# Altium schematic sheet MainBoard.schdoc
size 309 x 223 mm; Symbol: Sheet-Symbol_A4; Device: Sheet-Symbol_A4; @Page Name: P1; @Create Date: 2023-08-17; @Page Count: 1; @Page No: 1; @Project Name: IntelliTar; @Schematic Name: Schematic2; @Update Date: 2023-08-20; Company: 嘉立创EDA; Page Size: A4; Version: V1.0
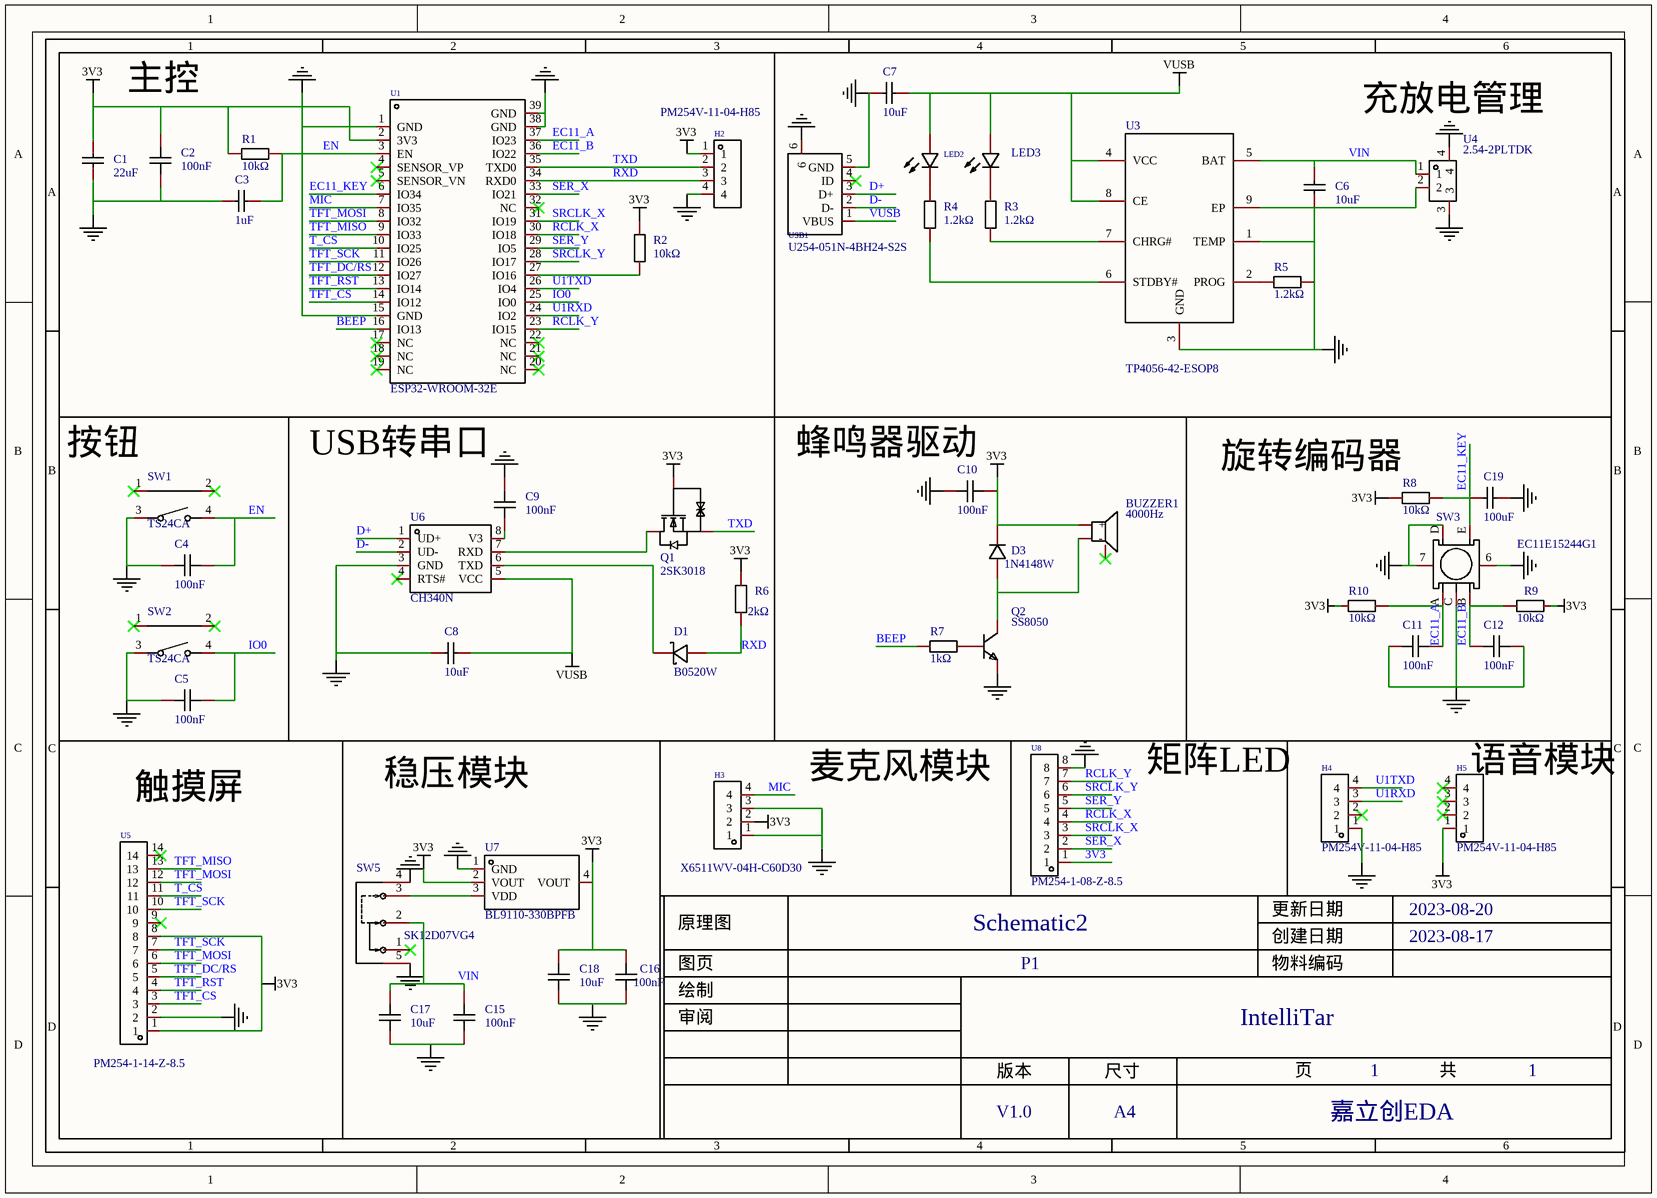
[diagram p0: MainBoard.schdoc]

## Parts
BUZZER1  4000Hz  [BUZ-SMD_L5.0-W5.5-P4.60]
C1  22uF  [C1206]
C2  100nF  [C0603]
C3  1uF  [C0603]
C4  100nF  [C0603]
C5  100nF  [C0603]
C6  10uF  [C0805]
C7  10uF  [C0805]
C8  10uF  [C0805]
C9  100nF  [C0603]
C10  100nF  [C0603]
C11  100nF  [C0603]
C12  100nF  [C0603]
C15  100nF  [C0603]
C16  100nF  [C0603]
C17  10uF  [C0603]
C18  10uF  [C0603]
C19  100uF  [C1206]
D1  B0520W  [SOD-123_L2.7-W1.6-LS3.7-RD]
D3  1N4148W  [SOD-123F_L2.7-W1.6-LS3.8-RD]
H2  PM254V-11-04-H85  [HDR-TH_4P-P2.54-V-F]
H3  X6511WV-04H-C60D30  [HDR-TH_4P-P2.54-V-M]
H4  PM254V-11-04-H85  [HDR-TH_4P-P2.54-V-F]
H5  PM254V-11-04-H85  [HDR-TH_4P-P2.54-V-F]
LED2  19-217/GHC-YR1S2/3T  [LED0603-RD]  (value not drawn)
LED3  NCD0603R1  [LED0603-RD_RED]  (value not drawn)
Q1  2SK3018  [SOT-23-3_L2.9-W1.4-P1.90-LS2.6-BR]
Q2  SS8050  [SOT-23-3_L2.9-W1.3-P1.90-LS2.4-BR]
R1  10kΩ  [R0603]
R2  10kΩ  [R0603]
R3  1.2kΩ  [R0603]
R4  1.2kΩ  [R0603]
R5  1.2kΩ  [R0603]
R6  2kΩ  [R0603]
R7  1kΩ  [R0603]
R8  10kΩ  [R0603]
R9  10kΩ  [R0603]
R10  10kΩ  [R0603]
SW1  TS24CA  [SW-SMD_TS24CA]
SW2  TS24CA  [SW-SMD_TS24CA]
SW3  EC11E15244G1  [SW-TH_EC11E15244G1]
SW5  SK12D07VG4  [SW-TH_SK12D07VG4]
U1  ESP32-WROOM-32E  [WIFI-SMD_ESP32-WROOM-32E-A]
U3  TP4056-42-ESOP8  [ESOP-8_L4.9-W3.9-P1.27-LS6.0-BL-EP]
U4  2.54-2PLTDK  [COMM-SMD_2P-P2.50_SHOUHAN_2.54-2PLTDK]
U5  PM254-1-14-Z-8.5  [HDR-TH_14P-P2.54-V-F-1]
U6  CH340N  [SOP-8_L5.0-W4.0-P1.27-LS6.0-BL]
U7  BL9110-330BPFB  [SOT-223_L6.5-W3.5-P2.30-LS7.0-BR]
U8  PM254-1-08-Z-8.5  [HDR-TH_8P-P2.54-V-F]
USB1  U254-051N-4BH24-S2S  [MICRO-USB-SMD_U254-051N-4BH24-S2]

## Blocks framed on the sheet
主控: C1-C3 H2 R1 R2 U1
充放电管理: C6 C7 LED2 LED3 R3-R5 U3 U4 USB1
按钮: C4 C5 SW1 SW2
USB转串口: C8 C9 D1 Q1 R6 U6
蜂鸣器驱动: BUZZER1 C10 D3 Q2 R7
旋转编码器: C11 C12 C19 R8-R10 SW3
触摸屏: U5
稳压模块: C15-C18 SW5 U7
麦克风模块: H3
矩阵LED: U8

## Nets
3V3: BUZZER1.1(+) C1.2 C2.2 C10.2 C16.2 C18.2 D3.1(K) H2.1 H3.2 H5.1 Q1.1(G) R1.1 R2.2 R6.2 R8.2 R9.2 R10.2 U1.2(3V3) U5.1 U5.8 U7.2(VOUT) U7.4(VOUT) U8.1
NetC1_1: C1.1 C2.1 C3.1 C4.1 C5.1 C6.2 C7.1 C8.1 C9.2 C10.1 C11.2 C12.2 C15.1 C16.1 C17.1 C18.1 C19.2 H2.4 H3.1 H3.3 H4.1 Q2.2(E) R5.2 SW1.3 SW2.3 SW3.6 SW3.7 SW3.C SW3.D SW5.4 SW5.5 U1.1(GND) U1.15(GND) U1.38(GND) U1.39(GND) U3.1(TEMP) U3.3(GND) U3.9(EP) U4.2 U4.3 U4.4 U5.2 U6.3(GND) U7.1(GND) U8.8 USB1.5(GND) USB1.6
VUSB: C7.2 C8.2 LED2.2(A) LED3.2(A) U3.4(VCC) U3.8(CE) U6.5(VCC) USB1.1(VBUS)
BEEP: R7.1 U1.16(IO13)
D+: U6.1(UD+) USB1.3(D+)
D-: U6.2(UD-) USB1.2(D-)
EC11_A: C11.1 R10.1 SW3.A U1.37(IO23)
EC11_B: C12.1 R9.1 SW3.B U1.36(IO22)
EC11_KEY: C19.1 R8.1 SW3.E U1.6(IO34)
EN: C3.2 C4.2 R1.2 SW1.4 U1.3(EN)
IO0: C5.2 SW2.4 U1.25(IO0)
MIC: H3.4 U1.7(IO35)
RCLK_X: U1.30(IO18) U8.4
RCLK_Y: U1.23(IO15) U8.7
RXD: D1.2(A) H2.3 R6.1 U1.34(RXD0)
SER_X: U1.33(IO21) U8.2
SER_Y: U1.29(IO5) U8.5
SRCLK_X: U1.31(IO19) U8.3
SRCLK_Y: U1.28(IO17) U8.6
T_CS: U1.10(IO25) U5.11
TFT_CS: U1.14(IO12) U5.3
TFT_DC/RS: U1.12(IO27) U5.5
TFT_MISO: U1.9(IO33) U5.13
TFT_MOSI: U1.8(IO32) U5.6 U5.12
TFT_RST: U1.13(IO14) U5.4
TFT_SCK: U1.11(IO26) U5.7 U5.10
TXD: H2.2 Q1.2(S) U1.35(TXD0)
U1RXD: H4.3 U1.24(IO2)
U1TXD: H4.4 U1.26(IO4)
VIN: C6.1 C15.2 C17.2 SW5.2 U3.5(BAT) U4.1
NetBUZZER1_2: BUZZER1.2(-) D3.2(A) Q2.3(C)
NetC9_1: C9.1 U6.8(V3)
NetD1_1: D1.1(C) U6.6(TXD)
NetLED2_1: LED2.1(C) R4.2
NetLED3_1: LED3.1(K) R3.2
NetQ1_3: Q1.3(D) U6.7(RXD)
NetQ2_1: Q2.1(B) R7.2
NetR2_1: R2.1 U1.27(IO16)
NetR3_1: R3.1 U3.7(CHRG#)
NetR4_1: R4.1 U3.6(STDBY#)
NetR5_1: R5.1 U3.2(PROG)
NetSW5_3: SW5.3 U7.3(VDD)

Not connected (* = marked no-connect by the designer): BUZZER1 3(NC)*; H4 2*; H5 2* 3* 4*; SW1 1* 2*; SW2 1* 2*; SW5 1*; U1 4(SENSOR_VP)* 5(SENSOR_VN)* 17(NC)* 18(NC)* 19(NC)* 20(NC)* 21(NC)* 22(NC)* 32(NC)*; U5 9* 14*; U6 4(RTS#)*; USB1 4(ID)*

## Notes on the sheet
- (near H5) 语音模块
- 1
- 2
- 3
- 4
- 5
- 6
- A
- B
- C
- 原理图
- Schematic2
- 创建日期
- 更新日期
- 2023-08-17
- 2023-08-20
- 审阅
- 绘制
- 图页
- P1
- 物料编码
- IntelliTar
- D
- 版本
- 尺寸
- 页
- 共
- V1.0
- A4
- 嘉立创EDA

## Library data of the parts
BUZZER1 = MLT-5020: 驱动方式:无源(外部驱动);构造类型:电磁式;频率:4000Hz;长度:5.2mm;宽度:5.2mm;高度:2.5mm;; Manufacturer: 华能; Add into BOM: yes; Technology Type: 电磁式; Name: 4000Hz; Symbol: MLT-5020; Device: MLT-5020; LCSC Part Name: MLT-5020; Supplier Part: C94598; Manufacturer Part: MLT-5020; Supplier Footprint: SMD,5x5mm; JLCPCB Part Class: 扩展库; Datasheet: https://atta.szlcsc.com/upload/public/pdf/source/20210811/111454390007D221D7259018FB170E62.pdf; Supplier: LCSC; Convert to PCB: yes; Oscillator Circuit: 无源(外部驱动); Value: 4000Hz; Length: 5.2mm; Width: 5.2mm; Height: 2.5mm
C1 = CL31A226KAHNNNE: 容值:22uF;精度:±10%;额定电压:25V;材质(温度系数):X5R;; Manufacturer: SAMSUNG(三星); Add into BOM: yes; Tolerance: ±10%; Voltage Rated: 25V; Temperature Coefficient: X5R; Name: 22uF; Symbol: CL31A226KAHNNNE; Device: CL31A226KAHNNNE; LCSC Part Name: 22uF ±10% 25V; Supplier Part: C12891; Manufacturer Part: CL31A226KAHNNNE; Supplier Footprint: 1206; JLCPCB Part Class: 基础库; Datasheet: https://atta.szlcsc.com/upload/public/pdf/source/20160103/1457707667836.pdf; Supplier: LCSC; Convert to PCB: yes; Value: 22uF
C2 C4 C5 C9-C12 C15 C16 = CC0603KRX7R9BB104: 容值:100nF;精度:±10%;额定电压:50V;材质(温度系数):X7R;; Manufacturer: YAGEO(国巨); Add into BOM: yes; Tolerance: ±10%; Voltage Rated: 50V; Temperature Coefficient: X7R; Name: 100nF; Symbol: CC0603KRX7R9BB104; Device: CC0603KRX7R9BB104; LCSC Part Name: 100nF ±10% 50V; Supplier Part: C14663; Manufacturer Part: CC0603KRX7R9BB104; Supplier Footprint: 0603; JLCPCB Part Class: 基础库; Datasheet: https://atta.szlcsc.com/upload/public/pdf/source/20180910/C282072_33301C7F631E79921B82A8DAC6BCC5B3.pdf; Supplier: LCSC; Convert to PCB: yes; Value: 100nF
C3 = CL10A105KB8NNNC: 容值:1uF;精度:±10%;额定电压:50V;材质(温度系数):X5R;; Manufacturer: SAMSUNG(三星); Add into BOM: yes; Tolerance: ±10%; Voltage Rated: 50V; Temperature Coefficient: X5R; Name: 1uF; Symbol: CL10A105KB8NNNC; Device: CL10A105KB8NNNC; LCSC Part Name: 1uF ±10% 50V; Supplier Part: C15849; Manufacturer Part: CL10A105KB8NNNC; Supplier Footprint: 0603; JLCPCB Part Class: 基础库; Datasheet: https://atta.szlcsc.com/upload/public/pdf/source/20160103/1457707679084.pdf; Supplier: LCSC; Convert to PCB: yes; Value: 1uF
C6-C8 = CL21A106KAYNNNE_C15850: 容值:10uF;精度:±10%;额定电压:25V;材质(温度系数):X5R;; Manufacturer: SAMSUNG(三星); Add into BOM: yes; Tolerance: ±10%; Voltage Rated: 25V; Temperature Coefficient: X5R; Name: 10uF; Symbol: CL21A106KAYNNNE; Device: CL21A106KAYNNNE_C15850; LCSC Part Name: 10uF ±10% 25V; Supplier Part: C15850; Manufacturer Part: CL21A106KAYNNNE; Supplier Footprint: 0805; JLCPCB Part Class: Basic Part; Datasheet: https://atta.szlcsc.com/upload/public/pdf/source/20160103/1457707679302.pdf; Supplier: LCSC; Convert to PCB: yes; Value: 10uF
C17 C18 = CL10A106MA8NRNC: 容值:10uF;精度:±20%;额定电压:25V;材质(温度系数):X5R;; Manufacturer: SAMSUNG(三星); Add into BOM: yes; Tolerance: ±20%; Voltage Rated: 25V; Temperature Coefficient: X5R; Name: 10uF; Symbol: CL10A106MA8NRNC; Device: CL10A106MA8NRNC; LCSC Part Name: 10uF ±20% 25V; Supplier Part: C96446; Manufacturer Part: CL10A106MA8NRNC; Supplier Footprint: 0603; JLCPCB Part Class: 基础库; Datasheet: https://atta.szlcsc.com/upload/public/pdf/source/20170325/1490427913016.pdf; Supplier: LCSC; Convert to PCB: yes; Value: 10uF
C19 = CL31A107MQHNNNE: 容值:100uF;精度:±20%;额定电压:6.3V;材质(温度系数):X5R;; Manufacturer: SAMSUNG(三星); Add into BOM: yes; Tolerance: ±20%; Voltage Rated: 6.3V; Temperature Coefficient: X5R; Name: 100uF; Symbol: CL31A107MQHNNNE; Device: CL31A107MQHNNNE; LCSC Part Name: 100uF ±20% 6.3V; Supplier Part: C15008; Manufacturer Part: CL31A107MQHNNNE; Supplier Footprint: 1206; JLCPCB Part Class: 基础库; Datasheet: https://atta.szlcsc.com/upload/public/pdf/source/20160103/1457707673200.pdf; Supplier: LCSC; Convert to PCB: yes; Value: 100uF
D1 = B0520W_C475609: Manufacturer: SHIKUES(时科); Add into BOM: yes; Name: B0520W; Symbol: B0520W; Device: B0520W_C475609; LCSC Part Name: B0520W; Supplier Part: C475609; Manufacturer Part: B0520W; Supplier Footprint: SHIKUES(时科); JLCPCB Part Class: 扩展库; Datasheet: https://atta.szlcsc.com/upload/public/pdf/source/20200102/C475609_13CB8AED5CC45AEB99C797609B0FD70E.pdf; Supplier: LCSC; Convert to PCB: yes
D3 = 1N4148W_C81598: 二极管配置:独立式;功率:400mW;直流反向耐压(Vr):75V;平均整流电流(Io):150mA;正向压降(Vf):1V@50mA;反向恢复时间(trr):4ns;; Manufacturer: ST(先科); Add into BOM: yes; Diode Configuration: 独立式; Power Dissipation: 400mW; Reverse Voltage (Vr): 75V; Average Rectified Current (Io): 150mA; Reverse Leakage Current: 1uA@75V; Reverse Recovery Time (trr): 4ns; Name: 1N4148W; Symbol: 1N4148W_C81598; Device: 1N4148W_C81598; LCSC Part Name: 75V 150mA 4ns; Supplier Part: C81598; Manufacturer Part: 1N4148W; Supplier Footprint: SOD-123; JLCPCB Part Class: 基础库; Datasheet: https://atta.szlcsc.com/upload/public/pdf/source/20161024/1477288446905.pdf; Supplier: LCSC; Convert to PCB: yes; Forward Voltage (Vf@If): 1V@50mA; Operating Temperature: +150℃@(Tj)
H2 H4 H5 = PM254V-11-04-H85: 排数:单排;总孔位数:4;间距:2.54mm;插孔结构:1x4P;行距:-;安装类型:直插;塑高:-;触头材质:黄铜;触头镀层:-;; Manufacturer: XFCN(兴飞); Add into BOM: yes; Number of Holes: 4; Pitch: 2.54mm; Holes Structure: 1x4P; Name: PM254V-11-04-H85; Symbol: PM254V-11-04-H85; Device: PM254V-11-04-H85; LCSC Part Name: 2.54mm 1x4P; Supplier Part: C541851; Manufacturer Part: PM254V-11-04-H85; Supplier Footprint: 直插,P=2.54mm; JLCPCB Part Class: 扩展库; Supplier: LCSC; Convert to PCB: yes; Number of Rows: 单排; Row Spacing: -; Mounting Type: 直插; Insulation Height: -; Contact Material: 黄铜; Contact Plating: -
H3 = X6511WV-04H-C60D30: 排数:单排;总PIN位数:4P;间距:2.54mm;插针结构:1x4P;行距:-;安装类型:直插;圆针/方针:方针;额定电流:3A;额定电压:250V;配合针长度:6mm;塑高:2.5mm;端接针长度:3mm;触头材质:黄铜;触头镀层:金;工作温度范围:-40℃~+105℃;焊接温度(最大值):260℃;颜色:黑色;; Manufacturer: XKB Connectivity(中国星坤); Symbol: X6511WV-04H-C30D60; Add into BOM: yes; Pitch: 2.54mm; Pin Structure: 1x4P; Circluar Pins/Square Pins: 方针; Current Rating (Max): 3A; Voltage Rating (Max): 250V; Welding Temperature (Max): 260℃; Name: X6511WV-04H-C60D30; Device: X6511WV-04H-C60D30; LCSC Part Name: 2.54mm 1x4P 直插 方针 镀金足1U; Supplier Part: C706876; Manufacturer Part: X6511WV-04H-C60D30; Supplier Footprint: 插件,P=2.54mm; JLCPCB Part Class: 扩展库; Datasheet: https://atta.szlcsc.com/upload/public/pdf/source/20211009/D19569EFFEB9776B42364DF7D41FD96A.pdf; Supplier: LCSC; Convert to PCB: yes; Number of Rows: 单排; Number of Pins: 4P; Row Spacing: -; Mounting Type: 直插; Length of Mating Pin: 6mm; Insulation Height: 2.5mm; Length of End Connection Pin: 3mm; Contact Material: 黄铜; Contact Plating: 金; Operating Temperature Range: -40℃~+105℃; Color: 黑色
LED2 = 19-217/GHC-YR1S2/3T: 发光颜色:翠绿;二极管配置:-;主波长:520nm~535nm;色温:-;功率:110mW;安装方式:-;; Manufacturer: EVERLIGHT(亿光); Add into BOM: yes; Emitted Color: 翠绿; Lens Color: 无色透明; Peak Wavelength: 518nm; Forward Current: 20mA; Power Dissipation: 110mW; Viewing Angle: 120°; Name: 19-217/GHC-YR1S2/3T; Symbol: 19-217/GHC-YR1S2/3T; Device: 19-217/GHC-YR1S2/3T; LCSC Part Name: 翠绿; Supplier Part: C72043; Manufacturer Part: 19-217/GHC-YR1S2/3T; Supplier Footprint: 0603; JLCPCB Part Class: 基础库; Datasheet: https://atta.szlcsc.com/upload/public/pdf/source/20160507/1462613613780.pdf; Supplier: LCSC; Convert to PCB: yes; Diode Configuration: -; Dominant Wavelength: 520nm~535nm; Color Temperature: -; Mounting Sytle: -; Operating Temperature: -40℃~+85℃
LED3 = NCD0603R1_C84263: 发光颜色:红灯;; Manufacturer: 国星光电; Symbol: FC-DA1608HRK-620D; Add into BOM: yes; Emitted Color: 红灯; Name: NCD0603R1; Device: NCD0603R1_C84263; LCSC Part Name: 红灯; Supplier Part: C84263; Manufacturer Part: NCD0603R1; Supplier Footprint: 0603; JLCPCB Part Class: 扩展库; Datasheet: https://atta.szlcsc.com/upload/public/pdf/source/20200820/C84263_DABC6A75E58F576973B407FDBA283D60.pdf; Supplier: LCSC; Convert to PCB: yes
Q1 = 2SK3018: 类型:-;漏源电压(Vdss):-;连续漏极电流(Id):-;功率(Pd):-;导通电阻(RDS(on)@Vgs,Id):-;阈值电压(Vgs(th)@Id):-;栅极电荷(Qg@Vgs):-;输入电容(Ciss@Vds):-;反向传输电容(Crss@Vds):-;; Manufacturer: TWGMC(台湾迪嘉); Symbol: 2SK3018_C727148; Add into BOM: yes; Name: 2SK3018; Device: 2SK3018; LCSC Part Name: 2SK3018; Supplier Part: C727148; Manufacturer Part: 2SK3018; Supplier Footprint: SOT-23; JLCPCB Part Class: 扩展库; Datasheet: https://atta.szlcsc.com/upload/public/pdf/source/20200827/C727148_2301BBDB89FCE642A4A39ABEF7075607.pdf; Supplier: LCSC; Convert to PCB: yes; Type: -; Drain Source Voltage (Vdss): -; Continuous Drain Current (Id): -; Power Dissipation (Pd): -; Drain Source On Resistance (RDS(on)@Vgs,Id): -; Gate Threshold Voltage (Vgs(th)@Id): -; Total Gate Charge (Qg@Vgs): -; Input Capacitance (Ciss@Vds): -; Reverse Transfer Capacitance (Crss@Vds): -
Q2 = SS8050_C2150: 晶体管类型:NPN;集射极击穿电压(Vceo):25V;集电极电流(Ic):1.5A;功率(Pd):300mW;直流电流增益(hFE@Ic,Vce):200@100mA,1V;; Manufacturer: CJ(江苏长电/长晶); Add into BOM: yes; Transistor Type: NPN; Collector-Emitter Breakdown Voltage (Vceo): 25V; Collector Current (Ic): 1.5A; Power Dissipation (Pd): 300mW; Collector Cut-Off Current (Icbo): 100nA; Collector-Emitter Saturation Voltage (VCE(sat)@Ic,Ib): 500mV@800mA,80mA; Transition Frequency (fT): 100MHz; Name: SS8050; Symbol: SS8050_C2150; Device: SS8050_C2150; LCSC Part Name: NPN 25V 1.5A Y1 200-350; Supplier Part: C2150; Manufacturer Part: SS8050; Supplier Footprint: SOT-23; JLCPCB Part Class: 基础库; Datasheet: https://atta.szlcsc.com/upload/public/pdf/source/20230322/AEE86F4B043774EFF80CAEA14A37D9E9.pdf; Supplier: LCSC; Convert to PCB: yes; DC Current Gain (hFE@Ic,Vce): 200@100mA,1V; Operating Temperature: +150℃@(Tj)
R1 R2 R8-R10 = 0603WAF1002T5E: 电阻类型:厚膜电阻;阻值:10kΩ;精度:±1%;功率:100mW;; Manufacturer: UNI-ROYAL(厚声); Add into BOM: yes; Tolerance: ±1%; Power(Watts): 100mW; Temperature Coefficient: ±100ppm/℃; Overload Voltage (Max): 75V; Name: 10kΩ; Symbol: 0603WAF1002T5E; Device: 0603WAF1002T5E; LCSC Part Name: 厚膜电阻 10kΩ ±1% 100mW; Supplier Part: C25804; Manufacturer Part: 0603WAF1002T5E; Supplier Footprint: 0603; JLCPCB Part Class: 基础库; Datasheet: https://atta.szlcsc.com/upload/public/pdf/source/20200306/C422600_1E6D84923E4A46A82E41ADD87F860B5C.pdf; Supplier: LCSC; Convert to PCB: yes; Type: 厚膜电阻; Value: 10kΩ; Operating Temperature Range: -55℃~+155℃
R3-R5 = 0603WAF1201T5E: 电阻类型:厚膜电阻;阻值:1.2kΩ;精度:±1%;功率:100mW;; Manufacturer: UNI-ROYAL(厚声); Add into BOM: yes; Tolerance: ±1%; Power(Watts): 100mW; Temperature Coefficient: ±100ppm/℃; Overload Voltage (Max): 75V; Name: 1.2kΩ; Symbol: 0603WAF1201T5E; Device: 0603WAF1201T5E; LCSC Part Name: 1.2kΩ ±1% 100mW; Supplier Part: C22765; Manufacturer Part: 0603WAF1201T5E; Supplier Footprint: 0603; JLCPCB Part Class: 基础库; Datasheet: https://atta.szlcsc.com/upload/public/pdf/source/20200306/C422600_1E6D84923E4A46A82E41ADD87F860B5C.pdf; Supplier: LCSC; Convert to PCB: yes; Type: 厚膜电阻; Value: 1.2kΩ; Operating Temperature Range: -55℃~+155℃
R6 = 0603WAF2001T5E: 电阻类型:厚膜电阻;阻值:2kΩ;精度:±1%;功率:100mW;; Manufacturer: UNI-ROYAL(厚声); Add into BOM: yes; Tolerance: ±1%; Power(Watts): 100mW; Temperature Coefficient: ±100ppm/℃; Overload Voltage (Max): 75V; Name: 2kΩ; Symbol: 0603WAF2001T5E; Device: 0603WAF2001T5E; LCSC Part Name: 2kΩ ±1% 100mW; Supplier Part: C22975; Manufacturer Part: 0603WAF2001T5E; Supplier Footprint: 0603; JLCPCB Part Class: 基础库; Datasheet: https://atta.szlcsc.com/upload/public/pdf/source/20200306/C422600_1E6D84923E4A46A82E41ADD87F860B5C.pdf; Supplier: LCSC; Convert to PCB: yes; Type: 厚膜电阻; Value: 2kΩ; Operating Temperature Range: -55℃~+155℃
R7 = 0603WAF1001T5E: 电阻类型:厚膜电阻;阻值:1kΩ;精度:±1%;功率:100mW;; Manufacturer: UNI-ROYAL(厚声); Add into BOM: yes; Tolerance: ±1%; Power(Watts): 100mW; Temperature Coefficient: ±100ppm/℃; Overload Voltage (Max): 75V; Name: 1kΩ; Symbol: 0603WAF1001T5E; Device: 0603WAF1001T5E; LCSC Part Name: 1kΩ ±1% 100mW; Supplier Part: C21190; Manufacturer Part: 0603WAF1001T5E; Supplier Footprint: 0603; JLCPCB Part Class: 基础库; Datasheet: https://atta.szlcsc.com/upload/public/pdf/source/20200306/C422600_1E6D84923E4A46A82E41ADD87F860B5C.pdf; Supplier: LCSC; Convert to PCB: yes; Type: 厚膜电阻; Value: 1kΩ; Operating Temperature Range: -55℃~+155℃
SW1 SW2 = TS24CA: 触点电流:50mA;额定电压(DC):12V;电路结构:单刀单掷;安装方式:卧贴;带灯:-;机械寿命:-;; Manufacturer: SHOU HAN(首韩); Add into BOM: yes; Contact Current: 50mA; Voltage Rating (DC): 12V; Circuit: 单刀单掷; Actuator Style: 矩形按钮; Switch Length: 4.55mm; Switch Width: 1.8mm; Switch Height: 3.5mm; Name: TS24CA; Symbol: TS24CA; Device: TS24CA; LCSC Part Name: 4.55*1.8*3.5mm 卧贴 轻触开关; Supplier Part: C393942; Manufacturer Part: TS24CA; Supplier Footprint: SMD; JLCPCB Part Class: 扩展库; Datasheet: https://atta.szlcsc.com/upload/public/pdf/source/20190521/C393942_591A9E318887EFA4274D34029981AD99.pdf; Supplier: LCSC; Convert to PCB: yes; Mounting Style: 卧贴; With Lamp: -; Mechanical Life: -
SW3 = EC11E15244G1: Manufacturer: ALPSALPINE(阿尔卑斯阿尔派); Add into BOM: yes; Name: EC11E15244G1; Symbol: EC11E15244G1; Device: EC11E15244G1; LCSC Part Name: 编码器; Supplier Part: C370970; Manufacturer Part: EC11E15244G1; Supplier Footprint: 插件; JLCPCB Part Class: 扩展库; Datasheet: https://atta.szlcsc.com/upload/public/pdf/source/20190222/C370970_45D3DFC793E5CF6FACAF06DB9E7FAE9E.pdf; Supplier: LCSC; Convert to PCB: yes
SW5 = SK12D07VG4: 额定电压 DC:50V;触点额定电流:500mA @ 50VDC;电路结构:SPDT;额定电压 AC:-;开关功能:On-On;; Manufacturer: SHOU HAN(首韩); Add into BOM: yes; Operating Force: 130~330gf; Rated Voltage(DC): 50V; Circuit: SPDT; Electrical Life Cycles: 5000; Switch Function: On-On; Switch Height: 4mm; Actuator Orientation: Horizontal; Contact Timing: Shorting (MBB); Actuator Type: Standard; Name: SK12D07VG4; Symbol: SK12D07VG4; Device: SK12D07VG4; LCSC Part Name: 3脚2二档位SK12D07VG4滑动开关1P2T卧式拨动开关; Supplier Part: C393937; Manufacturer Part: SK12D07VG4; Supplier Footprint: 插件,P=2mm; JLCPCB Part Class: 扩展库; Supplier: LCSC; Convert to PCB: yes; Contact Material: Brass; Contact Rating @ Voltage: 500mA @ 50VDC; Contact Finish: -; Operating Temperature: -; Rated Voltage(AC): -; Mounting Type: Through Hole, Right Angle; Termination Style: PC 引脚
U1 = ESP32-WROOM-32E: Manufacturer: ESPRESSIF(乐鑫); Symbol: ESP32-WROOM-32E-N4; Add into BOM: yes; Name: ESP32-WROOM-32E; Device: ESP32-WROOM-32E; LCSC Part Name: ESP32-WROOM-32E; Supplier Part: C2973652; Manufacturer Part: ESP32-WROOM-32E; Supplier Footprint: SMD,18x25.5mm; JLCPCB Part Class: 扩展库; Datasheet: https://atta.szlcsc.com/upload/public/pdf/source/20220506/2B7DF1E5B41DABC7447F735C715CAF22.pdf; Supplier: LCSC; Convert to PCB: yes
U3 = TP4056-42-ESOP8: 锂电池充电芯片; Manufacturer: TOPPOWER(南京拓微); Symbol: TP4056; Add into BOM: yes; Name: TP4056-42-ESOP8; Device: TP4056-42-ESOP8; LCSC Part Name: TP4056-42-ESOP8 编带; Supplier Part: C16581; Manufacturer Part: TP4056-42-ESOP8; Supplier Footprint: ESOP-8; JLCPCB Part Class: 基础库; Datasheet: https://atta.szlcsc.com/upload/public/pdf/source/20160713/1468379849914.pdf; Supplier: LCSC; Convert to PCB: yes
U4 = 2.54-2PLTDK: 间距:2.5mm;插针结构:1x2P;排数:1;每排PIN数:2;公母:公型插针;安装方式:立贴;额定电流:3A;工作温度范围:-25℃~+85℃;; Manufacturer: SHOU HAN(首韩); Add into BOM: yes; Pitch: 2.5mm; Pins Structure: 1x2P; Number of PINs Per Row: 2; Gender: 公型插针; Current Rating (Max): 3A; Name: 2.54-2PLTDK; Symbol: 2.54-2PLTDK; Device: 2.54-2PLTDK; LCSC Part Name: 2.5mm 1x2P 立贴 2.54间距 2P立贴 带扣; Supplier Part: C3008567; Manufacturer Part: 2.54-2PLTDK; Supplier Footprint: SMD,P=2.5mm; JLCPCB Part Class: 扩展库; Datasheet: https://atta.szlcsc.com/upload/public/pdf/source/20220427/1086FCB590FCB782B4D09F6F8756F690.pdf; Supplier: LCSC; Convert to PCB: yes; Number of Rows: 1; Mounting Style: 立贴; Operating Temperature Range: -25℃~+85℃
U5 = PM254-1-14-Z-8.5: 排数:单排;总孔位数:14;间距:2.54mm;插孔结构:1x14P;行距:-;安装类型:直插;圆孔/方孔:方孔;额定电流:3A;额定电压:-;插孔方向:顶部;塑高:8.5mm;工作温度范围:-40℃~+105℃;; Manufacturer: HCTL(华灿天禄); Add into BOM: yes; Number of Holes: 14; Pitch: 2.54mm; Holes Structure: 1x14P; Circular Hole / Square Hole: 方孔; Current Rating (Max): 3A; Holes Direction: 顶部; Name: PM254-1-14-Z-8.5; Symbol: PM254-1-14-Z-8.5; Device: PM254-1-14-Z-8.5; LCSC Part Name: 2.54mm 1x14P; Supplier Part: C2897377; Manufacturer Part: PM254-1-14-Z-8.5; Supplier Footprint: 插件,P=2.54mm; JLCPCB Part Class: 扩展库; Supplier: LCSC; Convert to PCB: yes; Number of Rows: 单排; Row Spacing: -; Mounting Type: 直插; Voltage Rating (Max): -; Insulation Height: 8.5mm; Operating Temperature Range: -40℃~+105℃
U6 = CH340N_C506813: 应用功能:-;接口协议:-;; Manufacturer: WCH(南京沁恒); Add into BOM: yes; Name: CH340N; Symbol: CH340N; Device: CH340N_C506813; LCSC Part Name: USB转串口芯片 CH340; Supplier Part: C506813; Manufacturer Part: CH340N; Supplier Footprint: SOP-8; JLCPCB Part Class: 扩展库; Datasheet: https://atta.szlcsc.com/upload/public/pdf/source/20200819/C84681_ADBED554CE321879DBD6B1D06488689C.pdf; Supplier: LCSC; Convert to PCB: yes; Applications Function: -; Protocol: -
U7 = BL9110-330BPFB: 输出类型:固定;输出极性:正;最大输入电压:6V;输出电压:3.3V;输出电流:1A;电源纹波抑制比(PSRR):70dB@(1kHz);; Manufacturer: BL(上海贝岭); Add into BOM: yes; Output Type: 固定; Output Polarity: 正; Number of Outputs: 1; Maximum Input Voltage: 6V; Output Voltage: 3.3V; Dropout Voltage: 390mV@(1A); Output Current: 1A; Name: BL9110-330BPFB; Symbol: BL9110-330BPFB; Device: BL9110-330BPFB; LCSC Part Name: 输入6V 输出3.3V 1A; Supplier Part: C169246; Manufacturer Part: BL9110-330BPFB; Supplier Footprint: SOT-223; JLCPCB Part Class: 扩展库; Datasheet: https://atta.szlcsc.com/upload/public/pdf/source/20180104/C169246_15150688220401230505.pdf; Supplier: LCSC; Convert to PCB: yes; Power Supply Rejection Ratio (PSRR): 70dB@(1kHz)
U8 = PM254-1-08-Z-8.5: 排数:单排;总孔位数:8P;间距:2.54mm;插孔结构:1x8P;行距:-;安装类型:直插;圆孔/方孔:方孔;额定电流:3A;额定电压:-;插孔方向:顶部;塑高:8.5mm;工作温度范围:-40℃~+105℃;; Manufacturer: HCTL(华灿天禄); Add into BOM: yes; Number of Holes: 8P; Pitch: 2.54mm; Holes Structure: 1x8P; Circular Hole / Square Hole: 方孔; Current Rating (Max): 3A; Holes Direction: 顶部; Name: PM254-1-08-Z-8.5; Symbol: PM254-1-08-Z-8.5; Device: PM254-1-08-Z-8.5; LCSC Part Name: 2.54mm 1x8P; Supplier Part: C2897371; Manufacturer Part: PM254-1-08-Z-8.5; Supplier Footprint: 插件,P=2.54mm; JLCPCB Part Class: 扩展库; Datasheet: https://atta.szlcsc.com/upload/public/pdf/source/20230609/534BE42964C679BDE98E061007C4ABD6.pdf; Supplier: LCSC; Convert to PCB: yes; Number of Rows: 单排; Row Spacing: -; Mounting Type: 直插; Voltage Rating (Max): -; Insulation Height: 8.5mm; Operating Temperature Range: -40℃~+105℃
USB1 = U254-051N-4BH24-S2S: 连接器类型:Micro-B;标准:USB 2.0;公母:母座;触点数量:5P;端口数量:1;安装方式:卧贴;额定电流 - 电源:1.8A;触头材质:铜合金;触头镀层:金;工作温度范围:-40℃~+85℃;焊接温度(最大值):260℃;; Manufacturer: XKB Connectivity(中国星坤); Add into BOM: yes; Gender: 母座; Number of Contacts: 5P; Number of Ports: 1; Current Rating - Power (Max): 1.8A; Welding Temperature (Max): 260℃; Name: U254-051N-4BH24-S2S; Symbol: U254-051N-4BH24-S2S; Device: U254-051N-4BH24-S2S; LCSC Part Name: Micro-B 母座 卧贴 牛角5.2; Supplier Part: C692421; Manufacturer Part: U254-051N-4BH24-S2S; Supplier Footprint: SMD; JLCPCB Part Class: 扩展库; Datasheet: https://atta.szlcsc.com/upload/public/pdf/source/20211011/B206D16459F712703796869A87C6FBF1.pdf; Supplier: LCSC; Convert to PCB: yes; Connector Type: Micro-B; Standard: USB 2.0; Mounting Style: 卧贴; Contact Material: 铜合金; Contact Plating: 金; Operating Temperature Range: -40℃~+85℃